# Altium schematic sheet 1_top.SchDoc
size A4
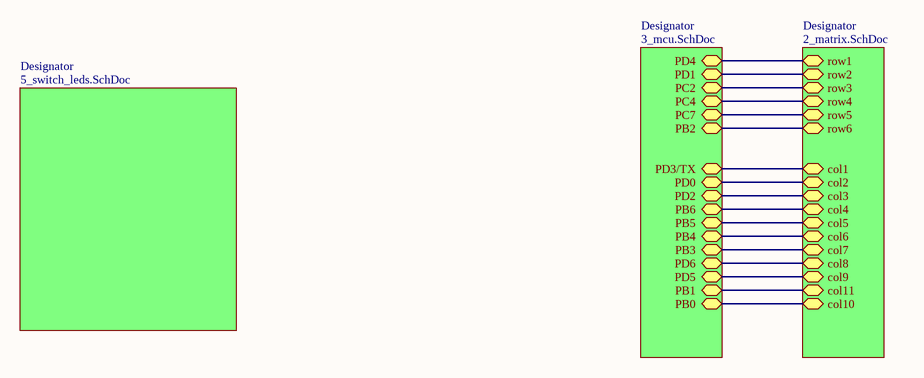
[diagram p0: 1_top.SchDoc]

## Sub-sheets
Designator = 2_matrix.SchDoc: col6, col8, col5, col7, col3, col2, col1, col4, col9, row3, row1, row4, row2, row6, row5, col11, col10
Designator = 3_mcu.SchDoc: PD3/TX, PD0, PD1, PC2, PD2, PD4, PC4, PD5, PB5, PB6, PB4, PB2, PD6, PB3, PB1, PB0, PC7
Designator = 5_switch_leds.SchDoc: no entries

## Nets
(unnamed): sheet Designator/col6, sheet Designator/PB4
(unnamed): sheet Designator/col8, sheet Designator/PD6
(unnamed): sheet Designator/col5, sheet Designator/PB5
(unnamed): sheet Designator/col7, sheet Designator/PB3
(unnamed): sheet Designator/col3, sheet Designator/PD2
(unnamed): sheet Designator/col2, sheet Designator/PD0
(unnamed): sheet Designator/col1, sheet Designator/PD3/TX
(unnamed): sheet Designator/col4, sheet Designator/PB6
(unnamed): sheet Designator/col9, sheet Designator/PD5
(unnamed): sheet Designator/row3, sheet Designator/PC2
(unnamed): sheet Designator/row1, sheet Designator/PD4
(unnamed): sheet Designator/row4, sheet Designator/PC4
(unnamed): sheet Designator/row2, sheet Designator/PD1
(unnamed): sheet Designator/row6, sheet Designator/PB2
(unnamed): sheet Designator/row5, sheet Designator/PC7
(unnamed): sheet Designator/col11, sheet Designator/PB1
(unnamed): sheet Designator/col10, sheet Designator/PB0